# Altium schematic sheet CorrosenseBoard_V4.2.SchDoc
size A2; SheetNumber: 1; SheetTotal: 8; SPICEModelCacheKYAFNCOO: <root> / <DocumentId>KYAFNCOO</DocumentId> / </root>
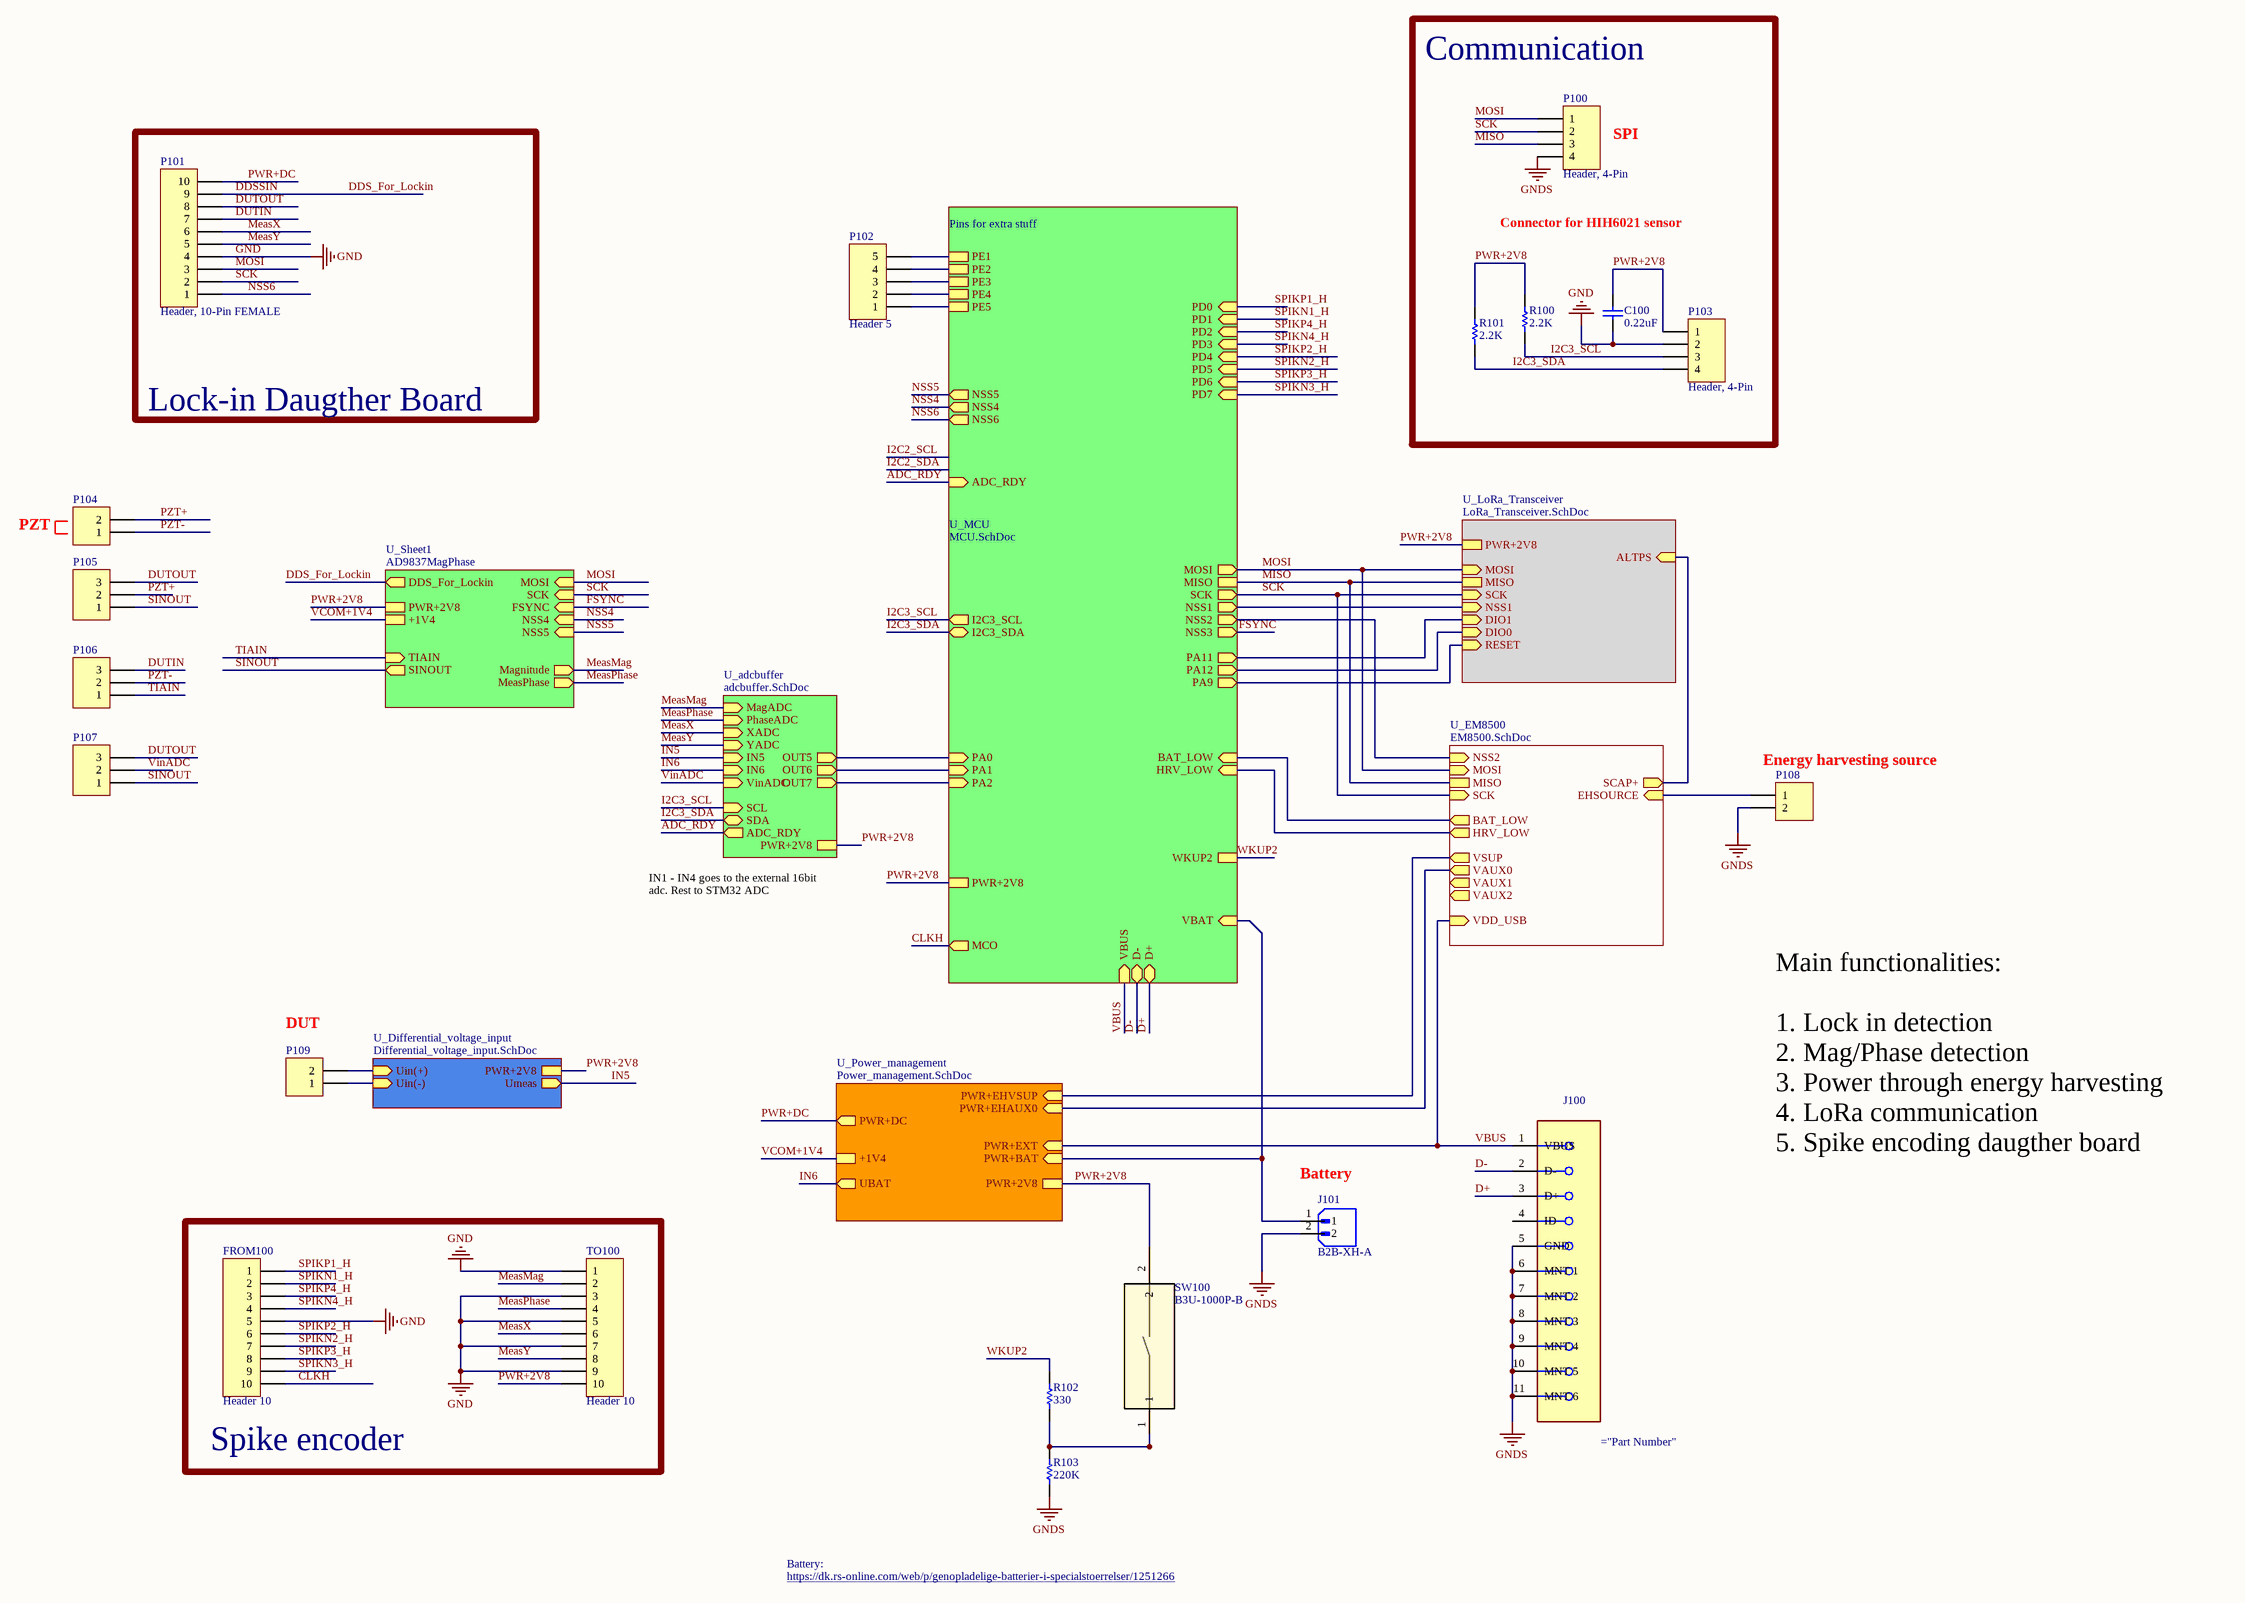
[diagram p0: CorrosenseBoard_V4.2.SchDoc]

## Parts
C100  0.22uF  [1608[0603]]
FROM100  Header 10  [HDR1X10]
J100  0473460001  [Molex_0473460001_0]  (value not drawn)
J101  B2B-XH-A  [JST_B2B-XH-A]
P100  Header, 4-Pin  [HDR1X4]
P101  Header, 10-Pin FEMALE  [HDR1X10]
P102  Header 5  [HDR1X5]
P103  Header, 4-Pin  [HDR1X4]
P104  Header, 2-Pin  [HDR1X2]  (value not drawn)
P105  Header, 3-Pin  [HDR1X3]  (value not drawn)
P106  Header, 3-Pin  [HDR1X3]  (value not drawn)
P107  Header, 3-Pin  [HDR1X3]  (value not drawn)
P108  Header, 2-Pin  [HDR1X2]  (value not drawn)
P109  Header, 2-Pin  [HDR1X2]  (value not drawn)
R100  2.2K  [1608[0603]]
R101  2.2K  [1608[0603]]
R102  330  [1608[0603]]
R103  220K  [1608[0603]]
SW100  B3U-1000P-B  [B3U-1000P-B]
TO100  Header 10  [HDR1X10]

## Blocks framed on the sheet
Communication: C100 P100 P103 R100 R101
Lock-in Daugther Board: P101
Spike encoder: FROM100 TO100

## Sub-sheets
U_adcbuffer = adcbuffer.SchDoc: MagADC (in), PhaseADC (in), XADC (in), YADC (in), IN5 (in), OUT5 (out), IN6 (in), OUT6 (out), VinADC (in), OUT7 (out), PWR+2V8, SCL (in), SDA (bidir), ADC_RDY (out)
U_Differential_voltage_input = Differential_voltage_input.SchDoc: Umeas (out), Uin(-) (in), Uin(+) (in), PWR+2V8
U_EM8500 = EM8500.SchDoc: MOSI (in), SCK (in), SCAP+ (out), VAUX2 (out), VAUX1 (out), VAUX0 (out), VSUP (out), BAT_LOW (out), HRV_LOW (out), VDD_USB (in), EHSOURCE (in), NSS2 (in), MISO
U_LoRa_Transceiver = LoRa_Transceiver.SchDoc: ALTPS (in), MOSI (in), SCK (in), RESET (in), NSS1 (in), DIO1 (in), DIO0 (in), PWR+2V8, MISO
U_MCU = MCU.SchDoc: PA0 (in), PA1 (in), PD2 (in), PA9 (out), PA11 (out), PA12 (out), WKUP2, MOSI (out), MISO, SCK (out), NSS1 (out), NSS3 (out), NSS2 (out), VBUS (in), D- (bidir), D+ (bidir), PWR+2V8, VBAT (in), I2C3_SCL (out), I2C3_SDA (bidir), PA2 (in), PD0 (in), PD1 (in), PD3 (in), PD4 (in), PD5 (in), PD6 (in), PD7 (in), PE1, PE2, PE3, PE4, PE5, NSS4 (out), NSS5 (out), ADC_RDY (in), NSS6 (out), MCO (out), HRV_LOW (in), BAT_LOW (in)
U_Power_management = Power_management.SchDoc: PWR+EXT (in), PWR+BAT (in), PWR+EHVSUP (in), PWR+EHAUX0 (in), PWR+2V8, PWR+DC (out), UBAT (out), +1V4
U_Sheet1 = AD9837MagPhase: MOSI (in), SCK (in), FSYNC (in), Magnitude (out), NSS4 (in), SINOUT (out), TIAIN (in), MeasPhase (out), PWR+2V8, +1V4, NSS5 (in), DDS_For_Lockin (out)

## Nets
GND: C100.1 FROM100.5 P101.4 P103.2 TO100.1 TO100.3 TO100.5 TO100.7 TO100.9
GNDS: J100.5(GND) J100.6(MNT_1) J100.7(MNT_2) J100.8(MNT_3) J100.9(MNT_4) J100.10(MNT_5) J100.11(MNT_6) J101.2 P100.4 P108.2 R103.1
ADC_RDY: sheet U_adcbuffer/ADC_RDY, sheet U_MCU/ADC_RDY
CLKH: FROM100.10 ; sheet U_MCU/MCO
D+: J100.3(D+) ; sheet U_MCU/D+
D-: J100.2(D-) ; sheet U_MCU/D-
DDS_For_Lockin: P101.9 ; sheet U_Sheet1/DDS_For_Lockin  [also labelled DDSSIN]
DUTIN: P101.7 P106.3
DUTOUT: P101.8 P105.3 P107.3
FSYNC: sheet U_MCU/NSS3, sheet U_Sheet1/FSYNC
I2C3_SCL: P103.3 R100.1 ; sheet U_adcbuffer/SCL, sheet U_MCU/I2C3_SCL
I2C3_SDA: P103.4 R101.1 ; sheet U_adcbuffer/SDA, sheet U_MCU/I2C3_SDA
IN5: sheet U_adcbuffer/IN5, sheet U_Differential_voltage_input/Umeas
IN6: sheet U_adcbuffer/IN6, sheet U_Power_management/UBAT
MeasMag: TO100.2 ; sheet U_adcbuffer/MagADC, sheet U_Sheet1/Magnitude
MeasPhase: TO100.4 ; sheet U_adcbuffer/PhaseADC, sheet U_Sheet1/MeasPhase
MeasX: P101.6 TO100.6 ; sheet U_adcbuffer/XADC
MeasY: P101.5 TO100.8 ; sheet U_adcbuffer/YADC
MISO: P100.3 ; sheet U_EM8500/MISO, sheet U_MCU/MISO, sheet U_LoRa_Transceiver/MISO
MOSI: P100.1 P101.3 ; sheet U_EM8500/MOSI, sheet U_MCU/MOSI, sheet U_LoRa_Transceiver/MOSI, sheet U_Sheet1/MOSI
NSS4: sheet U_MCU/NSS4, sheet U_Sheet1/NSS4
NSS5: sheet U_MCU/NSS5, sheet U_Sheet1/NSS5
NSS6: P101.1 ; sheet U_MCU/NSS6
PWR+2V8: C100.2 P103.1 R100.2 R101.2 SW100.2 TO100.10 ; sheet U_adcbuffer/PWR+2V8, sheet U_Differential_voltage_input/PWR+2V8, sheet U_MCU/PWR+2V8, sheet U_LoRa_Transceiver/PWR+2V8, sheet U_Power_management/PWR+2V8, sheet U_Sheet1/PWR+2V8
PWR+DC: P101.10 ; sheet U_Power_management/PWR+DC
PZT+: P104.2 P105.2
PZT-: P104.1 P106.2
SCK: P100.2 P101.2 ; sheet U_EM8500/SCK, sheet U_MCU/SCK, sheet U_LoRa_Transceiver/SCK, sheet U_Sheet1/SCK
SINOUT: P105.1 P107.1 ; sheet U_Sheet1/SINOUT
SPIKN1_H: FROM100.2 ; sheet U_MCU/PD1
SPIKN2_H: FROM100.7 ; sheet U_MCU/PD5
SPIKN3_H: FROM100.9 ; sheet U_MCU/PD7
SPIKN4_H: FROM100.4 ; sheet U_MCU/PD3
SPIKP1_H: FROM100.1 ; sheet U_MCU/PD0
SPIKP2_H: FROM100.6 ; sheet U_MCU/PD4
SPIKP3_H: FROM100.8 ; sheet U_MCU/PD6
SPIKP4_H: FROM100.3 ; sheet U_MCU/PD2
TIAIN: P106.1 ; sheet U_Sheet1/TIAIN
VBUS: J100.1(VBUS) ; sheet U_EM8500/VDD_USB, sheet U_MCU/VBUS, sheet U_Power_management/PWR+EXT
VCOM+1V4: sheet U_Power_management/+1V4, sheet U_Sheet1/+1V4
VinADC: P107.2 ; sheet U_adcbuffer/VinADC
WKUP2: R102.2 ; sheet U_MCU/WKUP2
NetJ101_1: J101.1 ; sheet U_MCU/VBAT, sheet U_Power_management/PWR+BAT
NetP102_1: P102.1 ; sheet U_MCU/PE5
NetP102_2: P102.2 ; sheet U_MCU/PE4
NetP102_3: P102.3 ; sheet U_MCU/PE3
NetP102_4: P102.4 ; sheet U_MCU/PE2
NetP102_5: P102.5 ; sheet U_MCU/PE1
NetP108_1: P108.1 ; sheet U_EM8500/EHSOURCE
NetP109_1: P109.1 ; sheet U_Differential_voltage_input/Uin(-)
NetP109_2: P109.2 ; sheet U_Differential_voltage_input/Uin(+)
NetR102_1: R102.1 R103.2 SW100.1
(unnamed): sheet U_adcbuffer/OUT5, sheet U_MCU/PA0
(unnamed): sheet U_adcbuffer/OUT6, sheet U_MCU/PA1
(unnamed): sheet U_adcbuffer/OUT7, sheet U_MCU/PA2
(unnamed): sheet U_EM8500/SCAP+, sheet U_LoRa_Transceiver/ALTPS
(unnamed): sheet U_EM8500/VAUX0, sheet U_Power_management/PWR+EHAUX0
(unnamed): sheet U_EM8500/VSUP, sheet U_Power_management/PWR+EHVSUP
(unnamed): sheet U_EM8500/BAT_LOW, sheet U_MCU/BAT_LOW
(unnamed): sheet U_EM8500/HRV_LOW, sheet U_MCU/HRV_LOW
(unnamed): sheet U_EM8500/NSS2, sheet U_MCU/NSS2
(unnamed): sheet U_MCU/PA9, sheet U_LoRa_Transceiver/RESET
(unnamed): sheet U_MCU/PA11, sheet U_LoRa_Transceiver/DIO1
(unnamed): sheet U_MCU/PA12, sheet U_LoRa_Transceiver/DIO0
(unnamed): sheet U_MCU/NSS1, sheet U_LoRa_Transceiver/NSS1

Not connected (* = marked no-connect by the designer): J100 4(ID)

## Notes on the sheet
- SPI
- Pins for extra stuff
- Connector for HIH6021 sensor
- PZT
- (near P108) Energy harvesting source
- IN1 - IN4 goes to the external 16bit adc. Rest to STM32 ADC
- (near P109) DUT
- (near J101) Battery
- Main functionalities:
  1. Lock in detection
  2. Mag/Phase detection
  3. Power through energy harvesting
  4. LoRa communication
  5. Spike encoding daugther board
- https://dk.rs-online.com/web/p/genopladelige-batterier-i-specialstoerrelser/1251266
- Battery:

## Library data of the parts
C100 = Cap: CAP CER 25V X7R 0603; Manufacturer: Murata Electronics; MPN: GCM188R71E224KA55D; Tolerance: ±10%; Value: 0.22uF; Operating Temperature: -55°C ~ 125°C; Package / Case: 0603 (1608 Metric); Temperature Coefficient: X7R; Voltage - Rated: 25V
FROM100 TO100 = Header 10: Header, 10-Pin; Manufacturer: Wurth Elektronik; MPN: 61301011121; Publisher: Altium Limited
J100 = 0473460001: USB Connectors MICRO USB B RECPT BTTM MOUNT ASSY; Manufacturer: Molex; MPN: 0473460001
J101 = B2B-XH-A: B2B-XH-A(LF)(SN); Manufacturer: JST Commercial; MF: {'manufacturer': u'JST Sales America Inc.'}; Package: None; Price: None; Value: B2B-XH-A(LF)(SN); MP: B2B-XH-A; Availability: Unavailable; MPN: B2B-XH-A(LF)(SN)
P100 P103 = Header 4: Manufacturer: Würth Elektronik; MPN: 61300411121; Publisher: Altium Limited
P101 = Header 10: Header, 10-Pin; Manufacturer: Wurth Elektronik; MPN: 61301011821; Publisher: Altium Limited
P102 = Header 5: Header, 5-Pin; Manufacturer: Würth Elektronik; MPN: 61300511121; Publisher: Altium Limited
P104 P108 P109 = Header 2: Manufacturer: Wurth Elektronik; MPN: 61300211121; Publisher: Altium Limited
P105-P107 = Header 3: Manufacturer: Wurth Elektronik; MPN: 61300311121; Publisher: Altium Limited
R100 = Res1: RES SMD 2% 1.5W 0603; Manufacturer: YAGEO; MPN: RC0603FR-072K2L; Publisher: Altium Limited; Value: 2.2K; Tolerance: 2%; Power (Watts): 1.5W; Composition: Thick Film; Operating Temperature: -65°C ~ 155°C; Package: 0603 (1608 Metric)
R101 = Res1: 1608[0603]; Manufacturer: YAGEO; MPN: RC0603FR-072K2L; Tolerance: 2%; Power (Watts): 1.5W; MP: -65°C ~ 155°C; Publisher: Altium Limited; Value: 2.2K; Composition: Thick Film; Operating Temperature: -65°C ~ 155°C; Code_JEITA: Thick Film; Package: 0603 (1608 Metric); PackageReference: 1.5W; Published: Altium Limited; Temperature Coefficient: 2%
R102 = Res1: 1608[0603]; Manufacturer: YAGEO; MPN: AC0603FR-07330RL; Tolerance: 2%; Power (Watts): 1.5W; MP: -65°C ~ 155°C; Publisher: Altium Limited; Value: 330; Composition: Thick Film; Operating Temperature: -65°C ~ 155°C; Code_JEITA: Thick Film; Package: 0603 (1608 Metric); PackageReference: 1.5W; Published: Altium Limited; Temperature Coefficient: 2%
R103 = Res1: 1608[0603]; Manufacturer: YAGEO; MPN: RC0603FR-07220KL; Tolerance: 2%; Power (Watts): 1.5W; MP: -65°C ~ 155°C; Publisher: Altium Limited; Value: 220K; Composition: Thick Film; Operating Temperature: -65°C ~ 155°C; Code_JEITA: Thick Film; Package: 0603 (1608 Metric); PackageReference: 1.5W; Published: Altium Limited; Temperature Coefficient: 2%
SW100 = B3U-1000P-B: No Description Available; Mfr_Name: Omron; Manufacturer: Omron Electronics; RefDes: RefDes; Type: Type; MPN: B3U-1000P-B